# Altium project SMD Brushed Motor Driver V3.PrjPcb
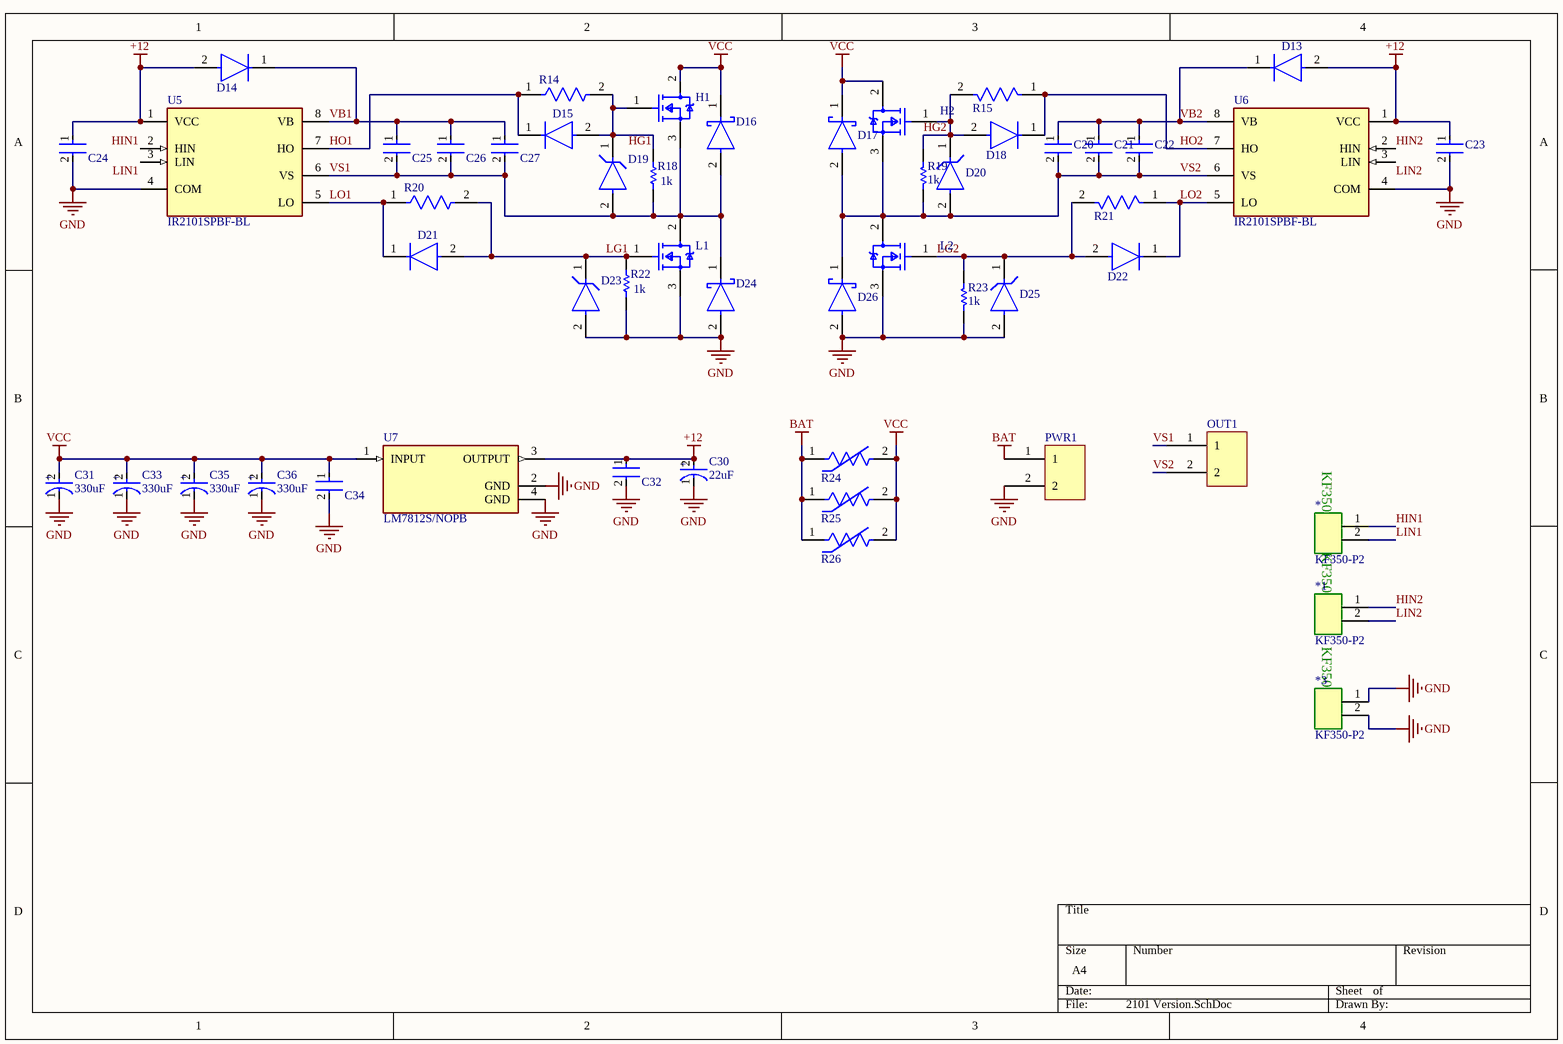
[diagram p0: 2101 Version.SchDoc]
2 sheets, 106 parts. Net scope: global (net labels, ports and power ports of the same name join across sheets).
Board files: SMD Brushed Motor Driver V3.PcbDoc, 2101 Version.PcbDoc, V4_with_2101.PcbDoc, 2110V3.1.PcbDoc
Sheets:
  2101 Version.SchDoc
  SMD Brushed Motor Driver V3.SchDoc

## Sheet 2101 Version.SchDoc
size A4; SheetNumber: 1; SheetTotal: 2

### Parts
*  KF350-P2  [New footprint 1]
*1  KF350-P2  [New footprint 1]
*3  KF350-P2  [New footprint 1]
C20  12061C474KAT2A  [FP-1206-L_3_2_0_2-W_1_6_0-IPC_B]  (value not drawn)
C21  12061C474KAT2A  [FP-1206-L_3_2_0_2-W_1_6_0-IPC_B]  (value not drawn)
C22  12061C474KAT2A  [FP-1206-L_3_2_0_2-W_1_6_0-IPC_B]  (value not drawn)
C23  12065C104KAT2A  [FP-1206-L_3_2_0_2-W_1_6_0-IPC_B]  (value not drawn)
C24  12065C104KAT2A  [FP-1206-L_3_2_0_2-W_1_6_0-IPC_B]  (value not drawn)
C25  12061C474KAT2A  [FP-1206-L_3_2_0_2-W_1_6_0-IPC_B]  (value not drawn)
C26  12061C474KAT2A  [FP-1206-L_3_2_0_2-W_1_6_0-IPC_B]  (value not drawn)
C27  12061C474KAT2A  [FP-1206-L_3_2_0_2-W_1_6_0-IPC_B]  (value not drawn)
C30  value 22uF  [FP-SD-MFG]  (hidden comment: EEE-1VA220SP 22uF 50V)
C31  value 330uF  [FP-UWT1V331MNL1GS-MFG]  (hidden comment: UWT1V331MNL1GS 330uF 35V smd)
C32  12065C104KAT2A  [FP-1206-L_3_2_0_2-W_1_6_0-IPC_B]  (value not drawn)
C33  value 330uF  [FP-UWT1V331MNL1GS-MFG]  (hidden comment: UWT1V331MNL1GS 330uF 35V smd)
C34  12065C104KAT2A  [FP-1206-L_3_2_0_2-W_1_6_0-IPC_B]  (value not drawn)
C35  value 330uF  [FP-UWT1V331MNL1GS-MFG]  (hidden comment: UWT1V331MNL1GS 330uF 35V smd)
C36  value 330uF  [FP-UWT1V331MNL1GS-MFG]  (hidden comment: UWT1V331MNL1GS 330uF 35V smd)
D13  MURS120T3G  [FP-403A-03-MFG]  (value not drawn)
D14  MURS120T3G  [FP-403A-03-MFG]  (value not drawn)
D15  MURS120T3G  [FP-403A-03-MFG]  (value not drawn)
D16  SS34-E3/57T  [FP-95402-MFG]  (value not drawn)
D17  SS34-E3/57T  [FP-95402-MFG]  (value not drawn)
D18  MURS120T3G  [FP-403A-03-MFG]  (value not drawn)
D19  TZMC3V3-GS08  [FP-6_560-5005_01-4-MFG]  (value not drawn)
D20  TZMC3V3-GS08  [FP-6_560-5005_01-4-MFG]  (value not drawn)
D21  MURS120T3G  [FP-403A-03-MFG]  (value not drawn)
D22  MURS120T3G  [FP-403A-03-MFG]  (value not drawn)
D23  TZMC3V3-GS08  [FP-6_560-5005_01-4-MFG]  (value not drawn)
D24  SS34-E3/57T  [FP-95402-MFG]  (value not drawn)
D25  TZMC3V3-GS08  [FP-6_560-5005_01-4-MFG]  (value not drawn)
D26  SS34-E3/57T  [FP-95402-MFG]  (value not drawn)
H1  IRF3205STRLPBF  [FP-PG-TO263-3-MFG]  (value not drawn)
H2  IRF3205STRLPBF  [FP-PG-TO263-3-MFG]  (value not drawn)
L1  IRF3205STRLPBF  [FP-PG-TO263-3-MFG]  (value not drawn)
L2  IRF3205STRLPBF  [FP-PG-TO263-3-MFG]  (value not drawn)
OUT1  2 pin terminal klemens  [New footprint 1]  (value not drawn)
PWR1  2 pin terminal klemens  [New footprint 1]  (value not drawn)
R14  RC1206JR-0710RL  [FP-RC1206-0_65-MFG]  (value not drawn)
R15  RC1206JR-0710RL  [FP-RC1206-0_65-MFG]  (value not drawn)
R18  value 1k  [RESC3116X70X50ML13T20]  (hidden comment: Resistor 1k +/-1% 1206 250 mW)
R19  value 1k  [RESC3116X70X50ML13T20]  (hidden comment: Resistor 1k +/-1% 1206 250 mW)
R20  RC1206JR-0710RL  [FP-RC1206-0_65-MFG]  (value not drawn)
R21  RC1206JR-0710RL  [FP-RC1206-0_65-MFG]  (value not drawn)
R22  value 1k  [RESC3116X70X50ML13T20]  (hidden comment: Resistor 1k +/-1% 1206 250 mW)
R23  value 1k  [RESC3116X70X50ML13T20]  (hidden comment: Resistor 1k +/-1% 1206 250 mW)
R24  20mm Body 7.5mm pitch Thermistor  [FP-NTPAD-MFG]  (value not drawn)
R25  20mm Body 7.5mm pitch Thermistor  [FP-NTPAD-MFG]  (value not drawn)
R26  20mm Body 7.5mm pitch Thermistor  [FP-NTPAD-MFG]  (value not drawn)
U5  IR2101SPBF-BL  [FP-PG-DSO-8-MFG]
U6  IR2101SPBF-BL  [FP-PG-DSO-8-MFG]
U7  LM7812S/NOPB  [FP-KTT0003B-MFG]

### Nets
+12: C23.1 C24.1 C30.2(A) C32.1 D13.2(A) D14.2(A) U5.1(VCC) U6.1(VCC) U7.3(OUTPUT)
BAT: PWR1.1 R24.1 R25.1 R26.1
GND: *3.1 *3.2 C23.2 C24.2 C30.1(C) C31.1(C) C32.2 C33.1(C) C34.2 C35.1(C) C36.1(C) D23.2(A) D24.2(A) D25.2(A) D26.2(A) L1.3(S) L2.3(S) PWR1.2 R22.2 R23.2 U5.4(COM) U6.4(COM) U7.2(GND) U7.4(GND)
VCC: C31.2(A) C33.2(A) C34.1 C35.2(A) C36.2(A) D16.1(C) D17.1(C) H1.2(D) H2.2(D) R24.2 R25.2 R26.2 U7.1(INPUT)
HG1: D15.2(A) D19.1(C) H1.1(G) R14.2 R18.1
HG2: D18.2(A) D20.1(C) H2.1(G) R15.2 R19.1
HIN1: *.1 U5.2(HIN)
HIN2: *1.1 U6.2(HIN)
HO1: D15.1(C) R14.1 U5.7(HO)
HO2: D18.1(C) R15.1 U6.7(HO)
LG1: D21.2(A) D23.1(C) L1.1(G) R20.2 R22.1
LG2: D22.2(A) D25.1(C) L2.1(G) R21.2 R23.1
LIN1: *.2 U5.3(LIN)
LIN2: *1.2 U6.3(LIN)
LO1: D21.1(C) R20.1 U5.5(LO)
LO2: D22.1(C) R21.1 U6.5(LO)
VB1: C25.1 C26.1 C27.1 D14.1(C) U5.8(VB)
VB2: C20.1 C21.1 C22.1 D13.1(C) U6.8(VB)
VS1: C25.2 C26.2 C27.2 D16.2(A) D19.2(A) D24.1(C) H1.3(S) L1.2(D) OUT1.1 R18.2 U5.6(VS)
VS2: C20.2 C21.2 C22.2 D17.2(A) D20.2(A) D26.1(C) H2.3(S) L2.2(D) OUT1.2 R19.2 U6.6(VS)

### Notes on the sheet
- (in symbol CMP-002-00078-2) KF350
- (in symbol CMP-000023-1) +
- (in symbol CMP-000026-1) +

### Library data of the parts
* *1 *3 = CMP-002-00078-2: 3.5mm mini klemens
C20-C22 C25-C27 = CMP-000013-1: 1206 470 nF 100 V ±10 % Tolerance X7R Surface Mount Multilayer Ceramic Capacitor
C23 C24 C32 C34 = CMP-001-00084-1: Ceramic capacitor SMD-1206 100nF /50V X7R# K +-10%, AVX, RoHS, /4000 reel/
C30 = CMP-000026-1: Cap Aluminum 22uF 35V 20% (6.3 X 5.4mm) SMD 60mA 2000h 85 C T/R; Case/Package: Radial; Diameter: 6.3mm; Construction: Cylindrical
C31 C33 C35 C36 = CMP-000023-1: Aluminum Electrolytic Capacitor, 330uF 35 V, WT Series 1000h 10 (Dia.) x 10mm; Diameter: 10mm; Construction: Cylindrical; Case/Package: Radial
D13-D15 D18 D21 D22 = CMP-004-00033-1: VR=200V IF=2A Trr=35ns
D16 D17 D24 D26 = CMP-000005-2: DIODE SCHOTTKY 40V 3A DO214AB
D19 D20 D23 D25 = CMP-000009-1: DIODE ZENER 3.3V 500MW SOD80
H1 H2 L1 L2 = CMP-013-00038-1: MOSFET N-CH 55V 110A D2PAK
OUT1 PWR1 = CMP-002-00072-2: 2 pin terminal klemens pin aralığı 200 mil
R14 R15 R20 R21 = CMP-000008-1: Res General Purpose Thick Film 1206 10 Ohm 5% 1/4W ±200ppm/°C Molded SMD Paper T/R
R18 R19 R22 R23 = CMP-009-00011-5: Chip Resistor, 1 KOhm, +/- 1%, 0.25 W, -55 to 155 degC, 1206 (3216 Metric); Voltage Rating: 200V; Power: 250mW; Max Operating Temperature: 155°C; Mounting Technology: SM; Tolerance: 1%; Case/Package: 1206; RoHS Compliant: True; Min Operating Temperature: -55°C; Pins: 2
R24-R26 = CMP-009-00184-2
U5 U6 = CMP-000015-1: MOSFET DRVR 600V 0.36A 2-OUT Hi/Lo Side Non-Inv 8-Pin SOIC
U7 = CMP-04917-000197-1: IC REG LINEAR 12V 1.5A; Quiescent Current: 8mA; Dropout Voltage: 2V; Lead Free: Contains Lead; RoHS Compliant: Yes; Min Operating Temperature: 0°C; Case/Package: TO-263; Max Operating Temperature: 125°C

## Sheet SMD Brushed Motor Driver V3.SchDoc
size A3; SheetNumber: 2; SheetTotal: 2
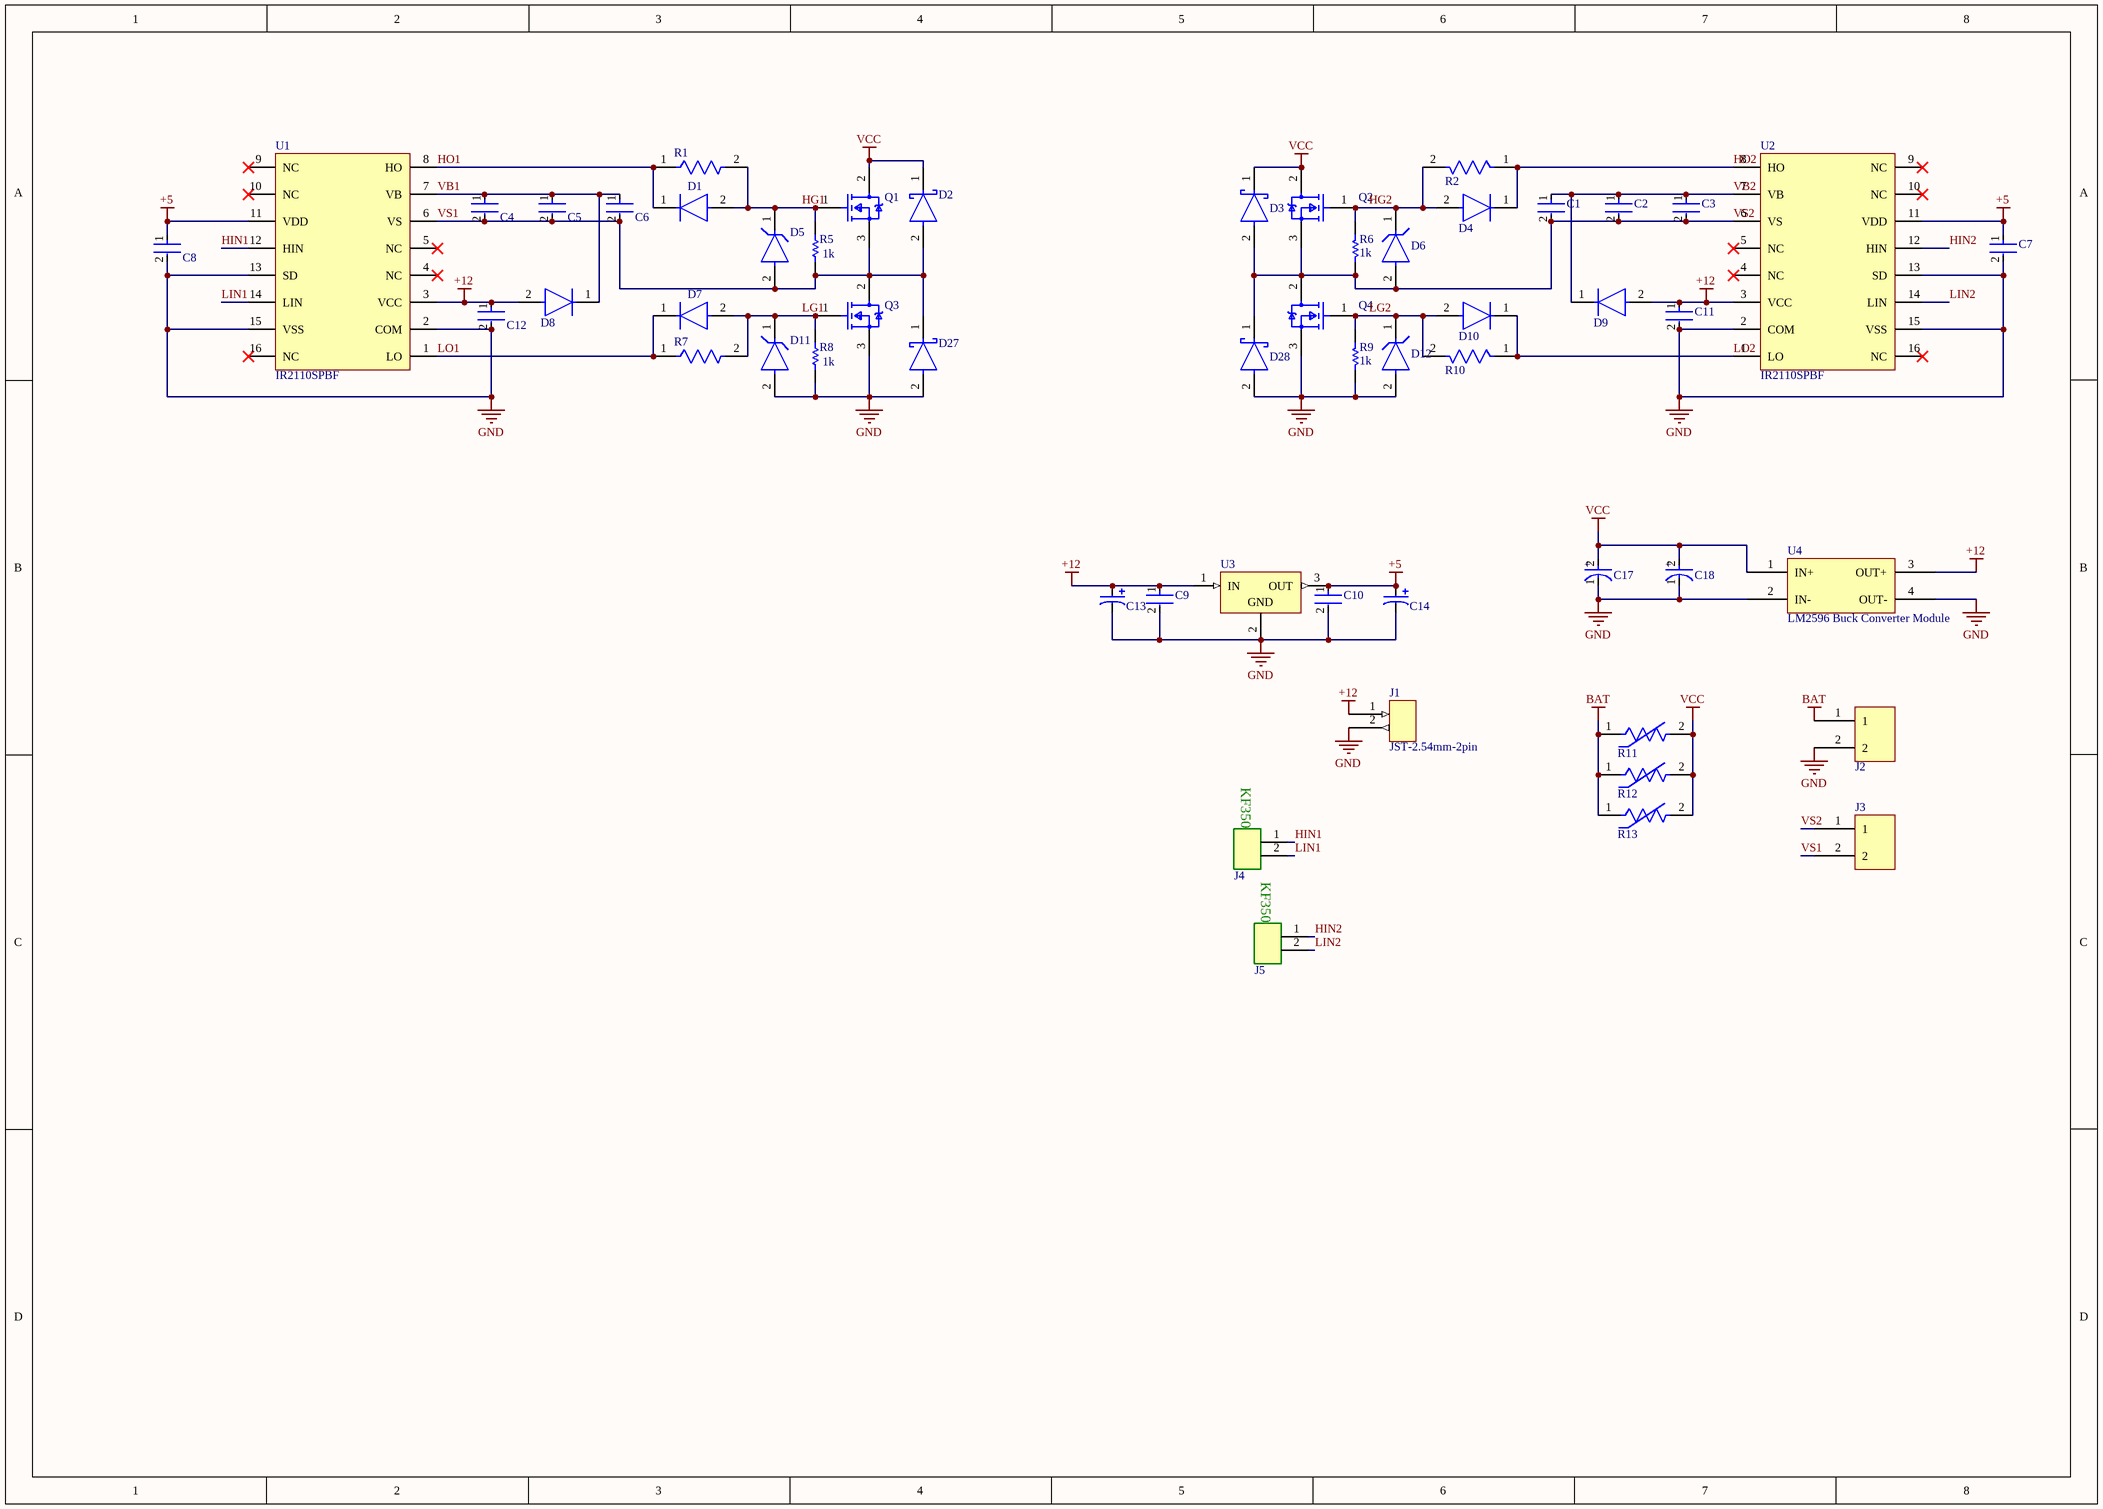
[diagram p1: SMD Brushed Motor Driver V3.SchDoc]

### Parts
C1  12061C474KAT2A  [FP-1206-L_3_2_0_2-W_1_6_0-IPC_B]  (value not drawn)
C2  12061C474KAT2A  [FP-1206-L_3_2_0_2-W_1_6_0-IPC_B]  (value not drawn)
C3  12061C474KAT2A  [FP-1206-L_3_2_0_2-W_1_6_0-IPC_B]  (value not drawn)
C4  12061C474KAT2A  [FP-1206-L_3_2_0_2-W_1_6_0-IPC_B]  (value not drawn)
C5  12061C474KAT2A  [FP-1206-L_3_2_0_2-W_1_6_0-IPC_B]  (value not drawn)
C6  12061C474KAT2A  [FP-1206-L_3_2_0_2-W_1_6_0-IPC_B]  (value not drawn)
C7  12065C104KAT2A  [FP-1206-L_3_2_0_2-W_1_6_0-IPC_B]  (value not drawn)
C8  12065C104KAT2A  [FP-1206-L_3_2_0_2-W_1_6_0-IPC_B]  (value not drawn)
C9  12065C104KAT2A  [FP-1206-L_3_2_0_2-W_1_6_0-IPC_B]  (value not drawn)
C10  12065C104KAT2A  [FP-1206-L_3_2_0_2-W_1_6_0-IPC_B]  (value not drawn)
C11  12065C104KAT2A  [FP-1206-L_3_2_0_2-W_1_6_0-IPC_B]  (value not drawn)
C12  12065C104KAT2A  [FP-1206-L_3_2_0_2-W_1_6_0-IPC_B]  (value not drawn)
C13  22 uF TH Electrolytic Capacitor  [22 uF TH Electrolytic Capacitor-Footprint-1]  (value not drawn)
C14  22 uF TH Electrolytic Capacitor  [22 uF TH Electrolytic Capacitor-Footprint-1]  (value not drawn)
C17  ECA1VM222  [FP-RAD-TH-D_16_0_5-L_25_2-MFG]  (value not drawn)
C18  ECA1VM222  [FP-RAD-TH-D_16_0_5-L_25_2-MFG]  (value not drawn)
D1  MURS120T3G  [FP-403A-03-MFG]  (value not drawn)
D2  SS34-E3/57T  [FP-95402-MFG]  (value not drawn)
D3  SS34-E3/57T  [FP-95402-MFG]  (value not drawn)
D4  MURS120T3G  [FP-403A-03-MFG]  (value not drawn)
D5  TZMC3V3-GS08  [FP-6_560-5005_01-4-MFG]  (value not drawn)
D6  TZMC3V3-GS08  [FP-6_560-5005_01-4-MFG]  (value not drawn)
D7  MURS120T3G  [FP-403A-03-MFG]  (value not drawn)
D8  MURS120T3G  [FP-403A-03-MFG]  (value not drawn)
D9  MURS120T3G  [FP-403A-03-MFG]  (value not drawn)
D10  MURS120T3G  [FP-403A-03-MFG]  (value not drawn)
D11  TZMC3V3-GS08  [FP-6_560-5005_01-4-MFG]  (value not drawn)
D12  TZMC3V3-GS08  [FP-6_560-5005_01-4-MFG]  (value not drawn)
D27  SS34-E3/57T  [FP-95402-MFG]  (value not drawn)
D28  SS34-E3/57T  [FP-95402-MFG]  (value not drawn)
J1  JST-2.54mm-2pin  [New footprint 1]
J2  2 pin terminal klemens  [New footprint 1]  (value not drawn)
J3  2 pin terminal klemens  [New footprint 1]  (value not drawn)
J4  KF350-P2  [New footprint 1]  (value not drawn)
J5  KF350-P2  [New footprint 1]  (value not drawn)
Q1  IRF3205STRLPBF  [FP-PG-TO263-3-MFG]  (value not drawn)
Q2  IRF3205STRLPBF  [FP-PG-TO263-3-MFG]  (value not drawn)
Q3  IRF3205STRLPBF  [FP-PG-TO263-3-MFG]  (value not drawn)
Q4  IRF3205STRLPBF  [FP-PG-TO263-3-MFG]  (value not drawn)
R1  RC1206JR-0710RL  [FP-RC1206-0_65-MFG]  (value not drawn)
R2  RC1206JR-0710RL  [FP-RC1206-0_65-MFG]  (value not drawn)
R5  value 1k  [RESC3116X70X50ML13T20]  (hidden comment: Resistor 1k +/-1% 1206 250 mW)
R6  value 1k  [RESC3116X70X50ML13T20]  (hidden comment: Resistor 1k +/-1% 1206 250 mW)
R7  RC1206JR-0710RL  [FP-RC1206-0_65-MFG]  (value not drawn)
R8  value 1k  [RESC3116X70X50ML13T20]  (hidden comment: Resistor 1k +/-1% 1206 250 mW)
R9  value 1k  [RESC3116X70X50ML13T20]  (hidden comment: Resistor 1k +/-1% 1206 250 mW)
R10  RC1206JR-0710RL  [FP-RC1206-0_65-MFG]  (value not drawn)
R11  20mm Body 7.5mm pitch Thermistor  [FP-NTPAD-MFG]  (value not drawn)
R12  20mm Body 7.5mm pitch Thermistor  [FP-NTPAD-MFG]  (value not drawn)
R13  20mm Body 7.5mm pitch Thermistor  [FP-NTPAD-MFG]  (value not drawn)
U1  IR2110SPBF  [IR2110SPBF-Footprint-1]
U2  IR2110SPBF  [IR2110SPBF-Footprint-1]
U3  LM7805CT  [FAIR-TO-220-3]  (value not drawn)
U4  LM2596 Buck Converter Module  [LM2596 Buck Converter Module-Footprint-1]

### Nets
+5: C7.1 C8.1 C10.1 C14.1 U1.11(VDD) U2.11(VDD) U3.3(OUT)
+12: C9.1 C11.1 C12.1 C13.1 D8.2(A) D9.2(A) J1.1 U1.3(VCC) U2.3(VCC) U3.1(IN) U4.3(OUT+)
BAT: J2.1 R11.1 R12.1 R13.1
GND: C7.2 C8.2 C9.2 C10.2 C11.2 C12.2 C13.2 C14.2 C17.1(C) C18.1(C) D11.2(A) D12.2(A) D27.2(A) D28.2(A) J1.2 J2.2 Q3.3(S) Q4.3(S) R8.2 R9.2 U1.2(COM) U1.13(SD) U1.15(VSS) U2.2(COM) U2.13(SD) U2.15(VSS) U3.2(GND) U4.2(IN-) U4.4(OUT-)
VCC: C17.2(A) C18.2(A) D2.1(C) D3.1(C) Q1.2(D) Q2.2(D) R11.2 R12.2 R13.2 U4.1(IN+)
HG1: D1.2(A) D5.1(C) Q1.1(G) R1.2 R5.1
HG2: D4.2(A) D6.1(C) Q2.1(G) R2.2 R6.1
HIN1: J4.1 U1.12(HIN)
HIN2: J5.1 U2.12(HIN)
HO1: D1.1(C) R1.1 U1.8(HO)
HO2: D4.1(C) R2.1 U2.8(HO)
LG1: D7.2(A) D11.1(C) Q3.1(G) R7.2 R8.1
LG2: D10.2(A) D12.1(C) Q4.1(G) R9.1 R10.2
LIN1: J4.2 U1.14(LIN)
LIN2: J5.2 U2.14(LIN)
LO1: D7.1(C) R7.1 U1.1(LO)
LO2: D10.1(C) R10.1 U2.1(LO)
VB1: C4.1 C5.1 C6.1 D8.1(C) U1.7(VB)
VB2: C1.1 C2.1 C3.1 D9.1(C) U2.7(VB)
VS1: C4.2 C5.2 C6.2 D2.2(A) D5.2(A) D27.1(C) J3.2 Q1.3(S) Q3.2(D) R5.2 U1.6(VS)
VS2: C1.2 C2.2 C3.2 D3.2(A) D6.2(A) D28.1(C) J3.1 Q2.3(S) Q4.2(D) R6.2 U2.6(VS)

Not connected (* = marked no-connect by the designer): U1 4(NC)* 5(NC)* 9(NC)* 10(NC)* 16(NC)*; U2 4(NC)* 5(NC)* 9(NC)* 10(NC)* 16(NC)*

### Notes on the sheet
- (in symbol CMP-002-00078-2) KF350
- (in symbol CMP-000011-3) +

### Library data of the parts
C1-C6 = CMP-000013-1: as C20 on sheet 2101 Version
C7-C12 = CMP-001-00084-1: as C23 on sheet 2101 Version
C13 C14 = CMP-000003-2
C17 C18 = CMP-000011-3: Cap Aluminum 2200uF 35V 20% (16 X 25mm) Radial 7.5mm 1250mA 2000h 85°C Bulk
D1 D4 D7-D10 = CMP-004-00033-1: VR=200V IF=2A Trr=35ns
D2 D3 D27 D28 = CMP-000005-2: DIODE SCHOTTKY 40V 3A DO214AB
D5 D6 D11 D12 = CMP-000009-1: DIODE ZENER 3.3V 500MW SOD80
J1 = CMP-000001-1: 2 pin konnektör
J2 J3 = CMP-002-00072-2: as OUT1 on sheet 2101 Version
J4 J5 = CMP-002-00078-2: 3.5mm mini klemens
Q1-Q4 = CMP-013-00038-1: MOSFET N-CH 55V 110A D2PAK
R1 R2 R7 R10 = CMP-000008-1: as R14 on sheet 2101 Version
R5 R6 R8 R9 = CMP-009-00011-5: as R18 on sheet 2101 Version; Max Operating Temperature: 155°C; Mounting Technology: SM; Tolerance: 1%; Case/Package: 1206; RoHS Compliant: True; Min Operating Temperature: -55°C; Pins: 2
R11-R13 = CMP-009-00184-2
U1 U2 = CMP-000016-1: 500 V high-side and low-side gate driver IC with shutdown, SOIC 16W, RoHS
U3 = CMP-000017-2: LM78XX Series 5 V Fixed Output 1 A 3-Terminal LDO Voltage Regulator - TO-220
U4 = CMP-00000-1

## Nets that join several sheets
+12: 2101 Version (9 pins), SMD Brushed Motor Driver V3 (11 pins)
BAT: 2101 Version (PWR1.1 R24.1 R25.1 R26.1), SMD Brushed Motor Driver V3 (J2.1 R11.1 R12.1 R13.1)
GND: 2101 Version (24 pins), SMD Brushed Motor Driver V3 (29 pins)
VCC: 2101 Version (13 pins), SMD Brushed Motor Driver V3 (10 pins)
HG1: 2101 Version (5 pins), SMD Brushed Motor Driver V3 (5 pins)
HG2: 2101 Version (5 pins), SMD Brushed Motor Driver V3 (5 pins)
HIN1: 2101 Version (*.1 U5.2), SMD Brushed Motor Driver V3 (J4.1 U1.12)
HIN2: 2101 Version (*1.1 U6.2), SMD Brushed Motor Driver V3 (J5.1 U2.12)
HO1: 2101 Version (D15.1 R14.1 U5.7), SMD Brushed Motor Driver V3 (D1.1 R1.1 U1.8)
HO2: 2101 Version (D18.1 R15.1 U6.7), SMD Brushed Motor Driver V3 (D4.1 R2.1 U2.8)
LG1: 2101 Version (5 pins), SMD Brushed Motor Driver V3 (5 pins)
LG2: 2101 Version (5 pins), SMD Brushed Motor Driver V3 (5 pins)
LIN1: 2101 Version (*.2 U5.3), SMD Brushed Motor Driver V3 (J4.2 U1.14)
LIN2: 2101 Version (*1.2 U6.3), SMD Brushed Motor Driver V3 (J5.2 U2.14)
LO1: 2101 Version (D21.1 R20.1 U5.5), SMD Brushed Motor Driver V3 (D7.1 R7.1 U1.1)
LO2: 2101 Version (D22.1 R21.1 U6.5), SMD Brushed Motor Driver V3 (D10.1 R10.1 U2.1)
VB1: 2101 Version (5 pins), SMD Brushed Motor Driver V3 (5 pins)
VB2: 2101 Version (5 pins), SMD Brushed Motor Driver V3 (5 pins)
VS1: 2101 Version (11 pins), SMD Brushed Motor Driver V3 (11 pins)
VS2: 2101 Version (11 pins), SMD Brushed Motor Driver V3 (11 pins)